# Altium project miClock.PrjPcb
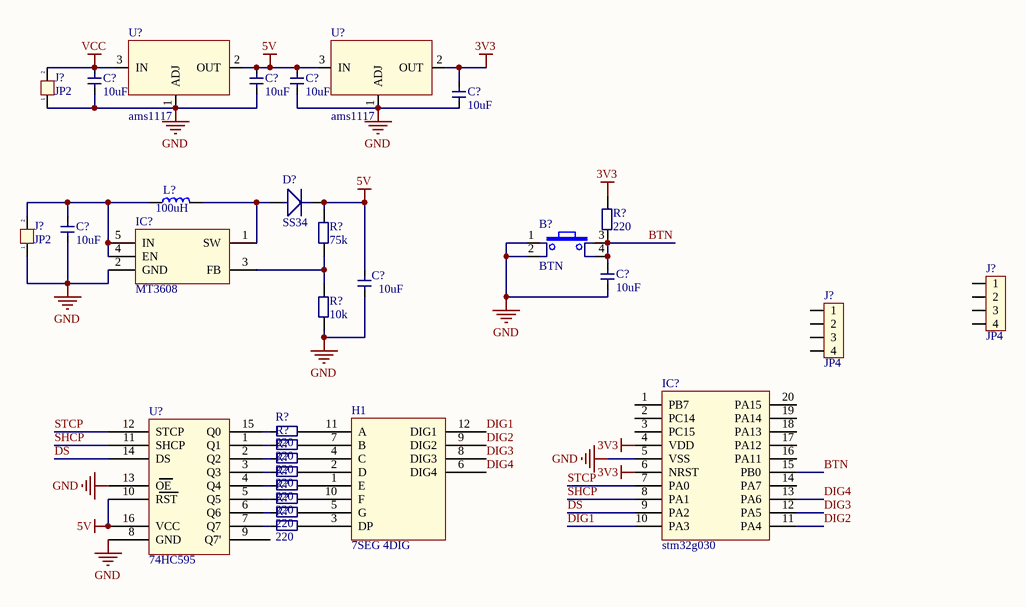
[diagram p0: miClock_sch.SchDoc]
1 sheet, 31 parts. Net scope: global (net labels, ports and power ports of the same name join across sheets).
Board file: miClock_pcb.PcbDoc

## Sheet miClock_sch.SchDoc
size A4; SheetNumber: 1; SheetTotal: 1

### Parts
(Parts that share a designator on the sheet are numbered #1, #2 ... from top to bottom, then left to right.)
B?  BTN  [BUTTON 4p 6x6]
C?#1  10uF  [cap 0805]
C?#2  10uF  [cap 0805]
C?#3  10uF  [cap 0805]
C?#4  10uF  [cap 0805]
C?#5  10uF  [cap 0805]
C?#6  10uF  [cap 0805]
C?#7  10uF  [cap 0805]
D?  SS34  [Diode SS34]
H1  7SEG 4DIG  [7SEG 4DIG]
IC?#1  MT3608  [MT3608  TSOT23-6]
IC?#2  stm32g030  [TSSOP20]
J?#1  JP2  [JP2]
J?#2  JP2  [JP2]
J?#3  JP4  [JP4]
J?#4  JP4  [JP4]
L?  100uH  [ind 74]
R?#1  220  [Res 0805]
R?#2  75k  [Res 0603]
R?#3  10k  [Res 0603]
R?#4  220  [Res 0805]
R?#5  220  [Res 0805]
R?#6  220  [Res 0805]
R?#7  220  [Res 0805]
R?#8  220  [Res 0805]
R?#9  220  [Res 0805]
R?#10  220  [Res 0805]
R?#11  220  [Res 0805]
U?#1  ams1117  [ams1117 SOT223]
U?#2  ams1117  [ams1117 SOT223]
U?#3  74HC595  [SOIC16]

### Nets
3V3: C?#4.2 IC?#2.4(VDD) IC?#2.6(NRST) R?#1.2 U?#2.2(OUT)
5V: C?#2.2 C?#3.2 C?#7.2 D?.2 R?#2.2 U?#1.2(OUT) U?#2.3(IN) U?#3.10(RST) U?#3.16(VCC)
GND: B?.1 B?.2 C?#1.1 C?#2.1 C?#3.1 C?#4.1 C?#5.1 C?#6.1 C?#7.1 IC?#1.2(GND) IC?#2.5(VSS) J?#1.1 J?#2.1 R?#3.1 U?#1.1(ADJ) U?#2.1(ADJ) U?#3.8(GND) U?#3.13(OE)
VCC: C?#1.2 J?#1.2 U?#1.3(IN)
BTN: B?.3 B?.4 C?#6.2 IC?#2.15(PB0) R?#1.1
DIG1: H1.12(DIG1) IC?#2.10(PA3)
DIG2: H1.9(DIG2) IC?#2.11(PA4)
DIG3: H1.8(DIG3) IC?#2.12(PA5)
DIG4: H1.6(DIG4) IC?#2.13(PA6)
DS: IC?#2.9(PA2) U?#3.14(DS)
SHCP: IC?#2.8(PA1) U?#3.11(SHCP)
STCP: IC?#2.7(PA0) U?#3.12(STCP)
NetC?#5_2: C?#5.2 IC?#1.4(EN) IC?#1.5(IN) J?#2.2 L?.1
NetD?_1: D?.1 IC?#1.1(SW) L?.2
NetH1_1: H1.1(E) R?#8.2
NetH1_2: H1.2(D) R?#7.2
NetH1_3: H1.3(DP) R?#11.2
NetH1_4: H1.4(C) R?#6.2
NetH1_5: H1.5(G) R?#10.2
NetH1_7: H1.7(B) R?#5.2
NetH1_10: H1.10(F) R?#9.2
NetH1_11: H1.11(A) R?#4.2
NetIC?#1_3: IC?#1.3(FB) R?#2.1 R?#3.2
NetR?#4_1: R?#4.1 U?#3.15(Q0)
NetR?#5_1: R?#5.1 U?#3.1(Q1)
NetR?#6_1: R?#6.1 U?#3.2(Q2)
NetR?#7_1: R?#7.1 U?#3.3(Q3)
NetR?#8_1: R?#8.1 U?#3.4(Q4)
NetR?#9_1: R?#9.1 U?#3.5(Q5)
NetR?#10_1: R?#10.1 U?#3.6(Q6)
NetR?#11_1: R?#11.1 U?#3.7(Q7)

Not connected (* = marked no-connect by the designer): IC?#2 1(PB7) 2(PC14) 3(PC15) 14(PA7) 16(PA11) 17(PA12) 18(PA13) 19(PA14) 20(PA15); J?#3 1 2 3 4; J?#4 1 2 3 4; U?#3 9(Q7')

### Library data of the parts
C?#1-C?#7 = cap
L? = INDUCTOR
R?#1-R?#11 = res